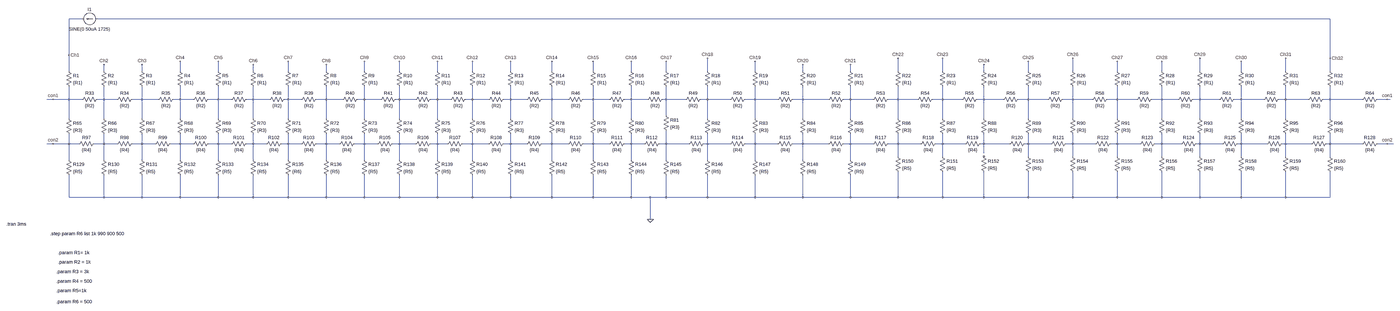
[diagram p0: schematic Resistor Phantom.asc, whole sheet]
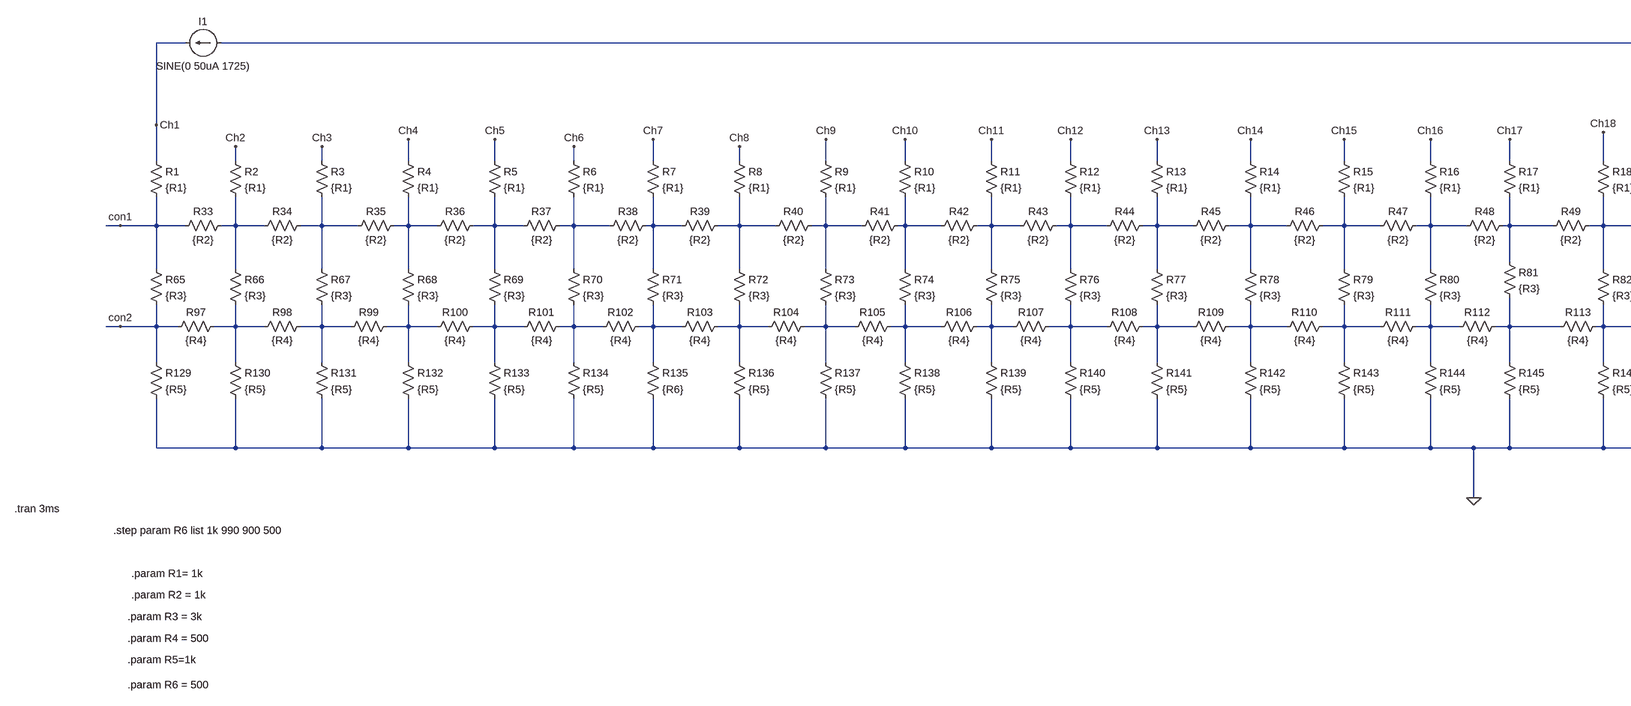
[diagram p1: schematic Resistor Phantom.asc, part, row 1 of 1, column 1 of 2]
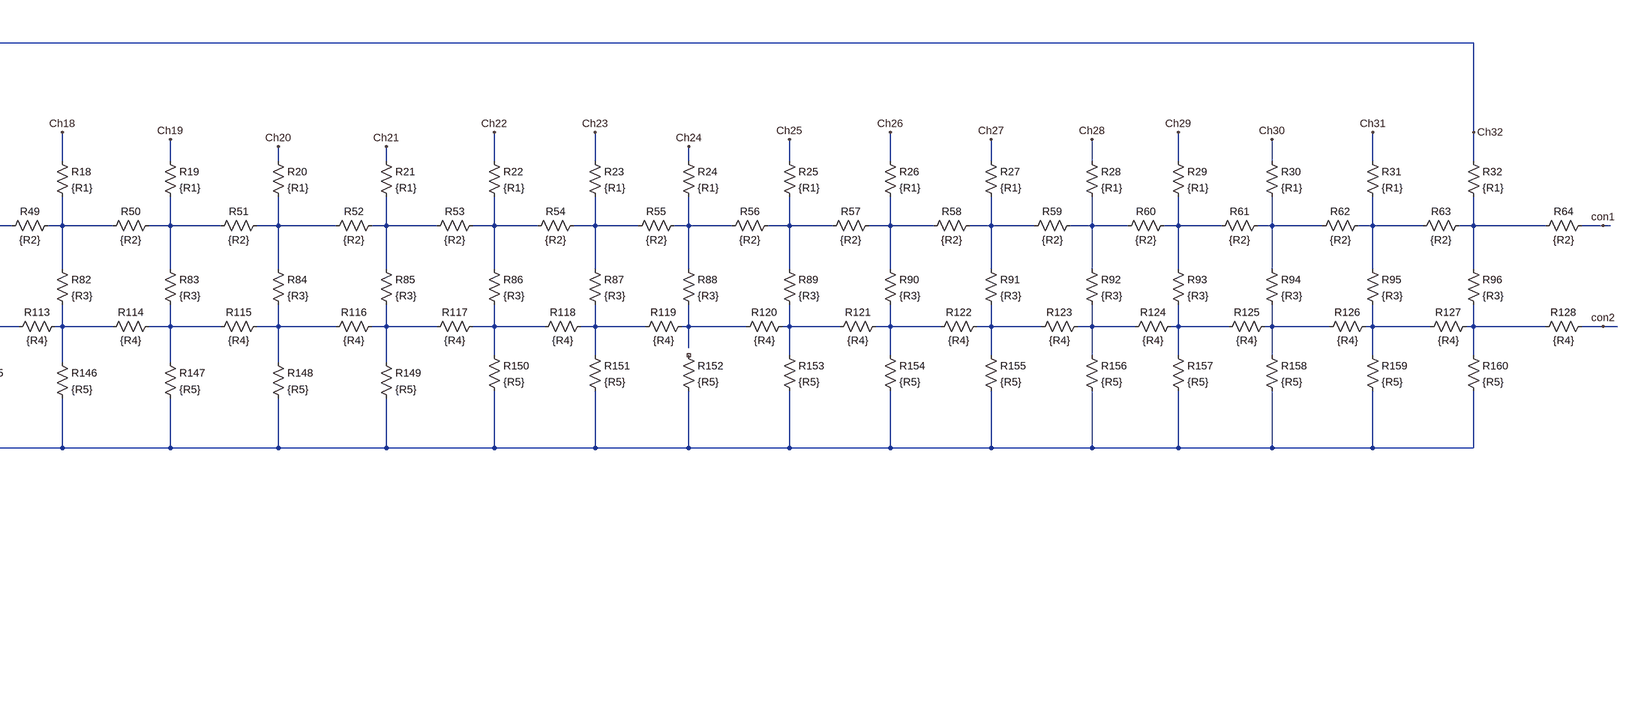
[diagram p2: schematic Resistor Phantom.asc, part, row 1 of 1, column 2 of 2]
Resistor Phantom.asc, the LTspice schematic file:
Version 4
SHEET 1 5484 864
WIRE -1136 -1120 -1200 -1120
WIRE 5152 -1120 -1056 -1120
WIRE -1200 -544 -1200 -1120
WIRE 5152 -528 5152 -1120
WIRE -1200 -464 -1200 -544
WIRE -1024 -464 -1024 -496
WIRE -832 -464 -832 -496
WIRE -640 -464 -640 -512
WIRE -448 -464 -448 -512
WIRE -272 -464 -272 -496
WIRE -96 -464 -96 -512
WIRE 96 -464 96 -496
WIRE 288 -464 288 -512
WIRE 464 -464 464 -512
WIRE 656 -464 656 -512
WIRE 832 -464 832 -512
WIRE 1024 -464 1024 -512
WIRE 1232 -464 1232 -512
WIRE 1440 -464 1440 -512
WIRE 1632 -464 1632 -512
WIRE 1808 -464 1808 -512
WIRE 2016 -464 2016 -528
WIRE 2256 -464 2256 -512
WIRE 2496 -464 2496 -496
WIRE 2736 -464 2736 -496
WIRE 2976 -464 2976 -528
WIRE 3200 -464 3200 -528
WIRE 3408 -464 3408 -496
WIRE 3632 -464 3632 -512
WIRE 3856 -464 3856 -528
WIRE 4080 -464 4080 -512
WIRE 4304 -464 4304 -512
WIRE 4496 -464 4496 -528
WIRE 4704 -464 4704 -512
WIRE 4928 -464 4928 -528
WIRE 5152 -464 5152 -528
WIRE -1280 -320 -1312 -320
WIRE -1200 -320 -1200 -384
WIRE -1200 -320 -1280 -320
WIRE -1136 -320 -1200 -320
WIRE -1024 -320 -1024 -384
WIRE -1024 -320 -1056 -320
WIRE -960 -320 -1024 -320
WIRE -832 -320 -832 -384
WIRE -832 -320 -880 -320
WIRE -752 -320 -832 -320
WIRE -640 -320 -640 -384
WIRE -640 -320 -672 -320
WIRE -576 -320 -640 -320
WIRE -448 -320 -448 -384
WIRE -448 -320 -496 -320
WIRE -384 -320 -448 -320
WIRE -272 -320 -272 -384
WIRE -272 -320 -304 -320
WIRE -192 -320 -272 -320
WIRE -96 -320 -96 -384
WIRE -96 -320 -112 -320
WIRE -32 -320 -96 -320
WIRE 96 -320 96 -384
WIRE 96 -320 48 -320
WIRE 176 -320 96 -320
WIRE 288 -320 288 -384
WIRE 288 -320 256 -320
WIRE 368 -320 288 -320
WIRE 464 -320 464 -384
WIRE 464 -320 448 -320
WIRE 544 -320 464 -320
WIRE 656 -320 656 -384
WIRE 656 -320 624 -320
WIRE 720 -320 656 -320
WIRE 832 -320 832 -384
WIRE 832 -320 800 -320
WIRE 912 -320 832 -320
WIRE 1024 -320 1024 -384
WIRE 1024 -320 992 -320
WIRE 1104 -320 1024 -320
WIRE 1232 -320 1232 -384
WIRE 1232 -320 1184 -320
WIRE 1312 -320 1232 -320
WIRE 1440 -320 1440 -384
WIRE 1440 -320 1392 -320
WIRE 1520 -320 1440 -320
WIRE 1632 -320 1632 -384
WIRE 1632 -320 1600 -320
WIRE 1712 -320 1632 -320
WIRE 1808 -320 1808 -384
WIRE 1808 -320 1792 -320
WIRE 1904 -320 1808 -320
WIRE 2016 -320 2016 -384
WIRE 2016 -320 1984 -320
WIRE 2128 -320 2016 -320
WIRE 2256 -320 2256 -384
WIRE 2256 -320 2208 -320
WIRE 2368 -320 2256 -320
WIRE 2496 -320 2496 -384
WIRE 2496 -320 2448 -320
WIRE 2624 -320 2496 -320
WIRE 2736 -320 2736 -384
WIRE 2736 -320 2704 -320
WIRE 2848 -320 2736 -320
WIRE 2976 -320 2976 -384
WIRE 2976 -320 2928 -320
WIRE 3072 -320 2976 -320
WIRE 3200 -320 3200 -384
WIRE 3200 -320 3152 -320
WIRE 3296 -320 3200 -320
WIRE 3408 -320 3408 -384
WIRE 3408 -320 3376 -320
WIRE 3504 -320 3408 -320
WIRE 3632 -320 3632 -384
WIRE 3632 -320 3584 -320
WIRE 3728 -320 3632 -320
WIRE 3856 -320 3856 -384
WIRE 3856 -320 3808 -320
WIRE 3952 -320 3856 -320
WIRE 4080 -320 4080 -384
WIRE 4080 -320 4032 -320
WIRE 4176 -320 4080 -320
WIRE 4304 -320 4304 -384
WIRE 4304 -320 4256 -320
WIRE 4384 -320 4304 -320
WIRE 4496 -320 4496 -384
WIRE 4496 -320 4464 -320
WIRE 4592 -320 4496 -320
WIRE 4704 -320 4704 -384
WIRE 4704 -320 4672 -320
WIRE 4816 -320 4704 -320
WIRE 4928 -320 4928 -384
WIRE 4928 -320 4896 -320
WIRE 5040 -320 4928 -320
WIRE 5152 -320 5152 -384
WIRE 5152 -320 5120 -320
WIRE 5312 -320 5152 -320
WIRE 5440 -320 5392 -320
WIRE 5456 -320 5440 -320
WIRE 1808 -240 1808 -320
WIRE -1200 -224 -1200 -320
WIRE -1024 -224 -1024 -320
WIRE -832 -224 -832 -320
WIRE -640 -224 -640 -320
WIRE -448 -224 -448 -320
WIRE -272 -224 -272 -320
WIRE -96 -224 -96 -320
WIRE 96 -224 96 -320
WIRE 288 -224 288 -320
WIRE 464 -224 464 -320
WIRE 656 -224 656 -320
WIRE 832 -224 832 -320
WIRE 1024 -224 1024 -320
WIRE 1232 -224 1232 -320
WIRE 1440 -224 1440 -320
WIRE 1632 -224 1632 -320
WIRE 2016 -224 2016 -320
WIRE 2256 -224 2256 -320
WIRE 2496 -224 2496 -320
WIRE 2736 -224 2736 -320
WIRE 2976 -224 2976 -320
WIRE 3200 -224 3200 -320
WIRE 3408 -224 3408 -320
WIRE 3632 -224 3632 -320
WIRE 3856 -224 3856 -320
WIRE 4080 -224 4080 -320
WIRE 4304 -224 4304 -320
WIRE 4496 -224 4496 -320
WIRE 4704 -224 4704 -320
WIRE 4928 -224 4928 -320
WIRE 5152 -224 5152 -320
WIRE -1280 -96 -1312 -96
WIRE -1200 -96 -1200 -144
WIRE -1200 -96 -1280 -96
WIRE -1152 -96 -1200 -96
WIRE -1024 -96 -1024 -144
WIRE -1024 -96 -1072 -96
WIRE -960 -96 -1024 -96
WIRE -832 -96 -832 -144
WIRE -832 -96 -880 -96
WIRE -768 -96 -832 -96
WIRE -640 -96 -640 -144
WIRE -640 -96 -688 -96
WIRE -576 -96 -640 -96
WIRE -448 -96 -448 -144
WIRE -448 -96 -496 -96
WIRE -384 -96 -448 -96
WIRE -272 -96 -272 -144
WIRE -272 -96 -304 -96
WIRE -208 -96 -272 -96
WIRE -96 -96 -96 -144
WIRE -96 -96 -128 -96
WIRE -32 -96 -96 -96
WIRE 96 -96 96 -144
WIRE 96 -96 48 -96
WIRE 160 -96 96 -96
WIRE 288 -96 288 -144
WIRE 288 -96 240 -96
WIRE 352 -96 288 -96
WIRE 464 -96 464 -144
WIRE 464 -96 432 -96
WIRE 544 -96 464 -96
WIRE 656 -96 656 -144
WIRE 656 -96 624 -96
WIRE 704 -96 656 -96
WIRE 832 -96 832 -144
WIRE 832 -96 784 -96
WIRE 912 -96 832 -96
WIRE 1024 -96 1024 -144
WIRE 1024 -96 992 -96
WIRE 1104 -96 1024 -96
WIRE 1232 -96 1232 -144
WIRE 1232 -96 1184 -96
WIRE 1312 -96 1232 -96
WIRE 1440 -96 1440 -144
WIRE 1440 -96 1392 -96
WIRE 1520 -96 1440 -96
WIRE 1632 -96 1632 -144
WIRE 1632 -96 1600 -96
WIRE 1696 -96 1632 -96
WIRE 1808 -96 1808 -160
WIRE 1808 -96 1776 -96
WIRE 1920 -96 1808 -96
WIRE 2016 -96 2016 -144
WIRE 2016 -96 2000 -96
WIRE 2128 -96 2016 -96
WIRE 2256 -96 2256 -144
WIRE 2256 -96 2208 -96
WIRE 2368 -96 2256 -96
WIRE 2496 -96 2496 -144
WIRE 2496 -96 2448 -96
WIRE 2624 -96 2496 -96
WIRE 2736 -96 2736 -144
WIRE 2736 -96 2704 -96
WIRE 2848 -96 2736 -96
WIRE 2976 -96 2976 -144
WIRE 2976 -96 2928 -96
WIRE 3088 -96 2976 -96
WIRE 3200 -96 3200 -144
WIRE 3200 -96 3168 -96
WIRE 3312 -96 3200 -96
WIRE 3408 -96 3408 -144
WIRE 3408 -96 3392 -96
WIRE 3536 -96 3408 -96
WIRE 3632 -96 3632 -144
WIRE 3632 -96 3616 -96
WIRE 3744 -96 3632 -96
WIRE 3856 -96 3856 -144
WIRE 3856 -96 3824 -96
WIRE 3968 -96 3856 -96
WIRE 4080 -96 4080 -144
WIRE 4080 -96 4048 -96
WIRE 4192 -96 4080 -96
WIRE 4304 -96 4304 -144
WIRE 4304 -96 4272 -96
WIRE 4400 -96 4304 -96
WIRE 4496 -96 4496 -144
WIRE 4496 -96 4480 -96
WIRE 4608 -96 4496 -96
WIRE 4704 -96 4704 -144
WIRE 4704 -96 4688 -96
WIRE 4832 -96 4704 -96
WIRE 4928 -96 4928 -144
WIRE 4928 -96 4912 -96
WIRE 5056 -96 4928 -96
WIRE 5152 -96 5152 -144
WIRE 5152 -96 5136 -96
WIRE 5312 -96 5152 -96
WIRE 5440 -96 5392 -96
WIRE 5472 -96 5440 -96
WIRE 3408 -48 3408 -96
WIRE 2976 -32 2976 -96
WIRE 3200 -32 3200 -96
WIRE 3632 -32 3632 -96
WIRE 3856 -32 3856 -96
WIRE 4080 -32 4080 -96
WIRE 4304 -32 4304 -96
WIRE 4496 -32 4496 -96
WIRE 4704 -32 4704 -96
WIRE 4928 -32 4928 -96
WIRE 5152 -32 5152 -96
WIRE -1200 -16 -1200 -96
WIRE -1024 -16 -1024 -96
WIRE -832 -16 -832 -96
WIRE -640 -16 -640 -96
WIRE -448 -16 -448 -96
WIRE -272 -16 -272 -96
WIRE -96 -16 -96 -96
WIRE 96 -16 96 -96
WIRE 288 -16 288 -96
WIRE 464 -16 464 -96
WIRE 656 -16 656 -96
WIRE 832 -16 832 -96
WIRE 1024 -16 1024 -96
WIRE 1232 -16 1232 -96
WIRE 1440 -16 1440 -96
WIRE 1632 -16 1632 -96
WIRE 1808 -16 1808 -96
WIRE 2016 -16 2016 -96
WIRE 2256 -16 2256 -96
WIRE 2496 -16 2496 -96
WIRE 2736 -16 2736 -96
WIRE -1200 304 -1200 64
WIRE -1024 304 -1024 64
WIRE -1024 304 -1200 304
WIRE -832 304 -832 64
WIRE -832 304 -1024 304
WIRE -640 304 -640 64
WIRE -640 304 -832 304
WIRE -448 304 -448 64
WIRE -448 304 -640 304
WIRE -272 304 -272 64
WIRE -272 304 -448 304
WIRE -96 304 -96 64
WIRE -96 304 -272 304
WIRE 96 304 96 64
WIRE 96 304 -96 304
WIRE 288 304 288 64
WIRE 288 304 96 304
WIRE 464 304 464 64
WIRE 464 304 288 304
WIRE 656 304 656 64
WIRE 656 304 464 304
WIRE 832 304 832 64
WIRE 832 304 656 304
WIRE 1024 304 1024 64
WIRE 1024 304 832 304
WIRE 1232 304 1232 64
WIRE 1232 304 1024 304
WIRE 1440 304 1440 64
WIRE 1440 304 1232 304
WIRE 1632 304 1632 64
WIRE 1632 304 1440 304
WIRE 1728 304 1632 304
WIRE 1808 304 1808 64
WIRE 1808 304 1728 304
WIRE 2016 304 2016 64
WIRE 2016 304 1808 304
WIRE 2256 304 2256 64
WIRE 2256 304 2016 304
WIRE 2496 304 2496 64
WIRE 2496 304 2256 304
WIRE 2736 304 2736 64
WIRE 2736 304 2496 304
WIRE 2976 304 2976 48
WIRE 2976 304 2736 304
WIRE 3200 304 3200 48
WIRE 3200 304 2976 304
WIRE 3408 304 3408 48
WIRE 3408 304 3200 304
WIRE 3632 304 3632 48
WIRE 3632 304 3408 304
WIRE 3856 304 3856 48
WIRE 3856 304 3632 304
WIRE 4080 304 4080 48
WIRE 4080 304 3856 304
WIRE 4304 304 4304 48
WIRE 4304 304 4080 304
WIRE 4496 304 4496 48
WIRE 4496 304 4304 304
WIRE 4704 304 4704 48
WIRE 4704 304 4496 304
WIRE 4928 304 4928 48
WIRE 4928 304 4704 304
WIRE 5152 304 5152 48
WIRE 5152 304 4928 304
WIRE 1728 432 1728 304
FLAG 1728 432 0
FLAG -1200 -544 Ch1
FLAG -1024 -496 Ch2
FLAG -832 -496 Ch3
FLAG -640 -512 Ch4
FLAG -448 -512 Ch5
FLAG -272 -496 Ch6
FLAG -96 -512 Ch7
FLAG 96 -496 Ch8
FLAG 288 -512 Ch9
FLAG 464 -512 Ch10
FLAG 656 -512 Ch11
FLAG 832 -512 Ch12
FLAG 1024 -512 Ch13
FLAG 1232 -512 Ch14
FLAG 1440 -512 Ch15
FLAG 1632 -512 Ch16
FLAG 1808 -512 Ch17
FLAG 2016 -528 Ch18
FLAG 2256 -512 Ch19
FLAG 2496 -496 Ch20
FLAG 2736 -496 Ch21
FLAG 2976 -528 Ch22
FLAG 3200 -528 Ch23
FLAG 3408 -496 Ch24
FLAG 3632 -512 Ch25
FLAG 3856 -528 Ch26
FLAG 4080 -512 Ch27
FLAG 4304 -512 Ch28
FLAG 4496 -528 Ch29
FLAG 4704 -512 Ch30
FLAG 4928 -528 Ch31
FLAG 5152 -528 Ch32
FLAG -1280 -320 con1
FLAG 5440 -320 con1
FLAG 5440 -96 con2
FLAG -1280 -96 con2
SYMBOL res -1216 -480 R0
SYMATTR InstName R1
SYMATTR Value {R1}
SYMBOL res -1040 -480 R0
SYMATTR InstName R2
SYMATTR Value {R1}
SYMBOL res -848 -480 R0
SYMATTR InstName R3
SYMATTR Value {R1}
SYMBOL res -656 -480 R0
SYMATTR InstName R4
SYMATTR Value {R1}
SYMBOL res -464 -480 R0
SYMATTR InstName R5
SYMATTR Value {R1}
SYMBOL res -288 -480 R0
SYMATTR InstName R6
SYMATTR Value {R1}
SYMBOL res -112 -480 R0
SYMATTR InstName R7
SYMATTR Value {R1}
SYMBOL res 80 -480 R0
SYMATTR InstName R8
SYMATTR Value {R1}
SYMBOL res 272 -480 R0
SYMATTR InstName R9
SYMATTR Value {R1}
SYMBOL res 448 -480 R0
SYMATTR InstName R10
SYMATTR Value {R1}
SYMBOL res 640 -480 R0
SYMATTR InstName R11
SYMATTR Value {R1}
SYMBOL res 816 -480 R0
SYMATTR InstName R12
SYMATTR Value {R1}
SYMBOL res 1008 -480 R0
SYMATTR InstName R13
SYMATTR Value {R1}
SYMBOL res 1216 -480 R0
SYMATTR InstName R14
SYMATTR Value {R1}
SYMBOL res 1424 -480 R0
SYMATTR InstName R15
SYMATTR Value {R1}
SYMBOL res 1616 -480 R0
SYMATTR InstName R16
SYMATTR Value {R1}
SYMBOL res 1792 -480 R0
SYMATTR InstName R17
SYMATTR Value {R1}
SYMBOL res 2000 -480 R0
SYMATTR InstName R18
SYMATTR Value {R1}
SYMBOL res 2240 -480 R0
SYMATTR InstName R19
SYMATTR Value {R1}
SYMBOL res 2480 -480 R0
SYMATTR InstName R20
SYMATTR Value {R1}
SYMBOL res 2720 -480 R0
SYMATTR InstName R21
SYMATTR Value {R1}
SYMBOL res 2960 -480 R0
SYMATTR InstName R22
SYMATTR Value {R1}
SYMBOL res 3184 -480 R0
SYMATTR InstName R23
SYMATTR Value {R1}
SYMBOL res 3392 -480 R0
SYMATTR InstName R24
SYMATTR Value {R1}
SYMBOL res 3616 -480 R0
SYMATTR InstName R25
SYMATTR Value {R1}
SYMBOL res 3840 -480 R0
SYMATTR InstName R26
SYMATTR Value {R1}
SYMBOL res 4064 -480 R0
SYMATTR InstName R27
SYMATTR Value {R1}
SYMBOL res 4288 -480 R0
SYMATTR InstName R28
SYMATTR Value {R1}
SYMBOL res 4480 -480 R0
SYMATTR InstName R29
SYMATTR Value {R1}
SYMBOL res 4688 -480 R0
SYMATTR InstName R30
SYMATTR Value {R1}
SYMBOL res 4912 -480 R0
SYMATTR InstName R31
SYMATTR Value {R1}
SYMBOL res 5136 -480 R0
SYMATTR InstName R32
SYMATTR Value {R1}
SYMBOL res -1040 -336 R90
WINDOW 0 0 56 VBottom 2
WINDOW 3 32 56 VTop 2
SYMATTR InstName R33
SYMATTR Value {R2}
SYMBOL res -864 -336 R90
WINDOW 0 0 56 VBottom 2
WINDOW 3 32 56 VTop 2
SYMATTR InstName R34
SYMATTR Value {R2}
SYMBOL res -656 -336 R90
WINDOW 0 0 56 VBottom 2
WINDOW 3 32 56 VTop 2
SYMATTR InstName R35
SYMATTR Value {R2}
SYMBOL res -480 -336 R90
WINDOW 0 0 56 VBottom 2
WINDOW 3 32 56 VTop 2
SYMATTR InstName R36
SYMATTR Value {R2}
SYMBOL res -288 -336 R90
WINDOW 0 0 56 VBottom 2
WINDOW 3 32 56 VTop 2
SYMATTR InstName R37
SYMATTR Value {R2}
SYMBOL res -96 -336 R90
WINDOW 0 0 56 VBottom 2
WINDOW 3 32 56 VTop 2
SYMATTR InstName R38
SYMATTR Value {R2}
SYMBOL res 64 -336 R90
WINDOW 0 0 56 VBottom 2
WINDOW 3 32 56 VTop 2
SYMATTR InstName R39
SYMATTR Value {R2}
SYMBOL res 272 -336 R90
WINDOW 0 0 56 VBottom 2
WINDOW 3 32 56 VTop 2
SYMATTR InstName R40
SYMATTR Value {R2}
SYMBOL res 464 -336 R90
WINDOW 0 0 56 VBottom 2
WINDOW 3 32 56 VTop 2
SYMATTR InstName R41
SYMATTR Value {R2}
SYMBOL res 640 -336 R90
WINDOW 0 0 56 VBottom 2
WINDOW 3 32 56 VTop 2
SYMATTR InstName R42
SYMATTR Value {R2}
SYMBOL res 816 -336 R90
WINDOW 0 0 56 VBottom 2
WINDOW 3 32 56 VTop 2
SYMATTR InstName R43
SYMATTR Value {R2}
SYMBOL res 1008 -336 R90
WINDOW 0 0 56 VBottom 2
WINDOW 3 32 56 VTop 2
SYMATTR InstName R44
SYMATTR Value {R2}
SYMBOL res 1200 -336 R90
WINDOW 0 0 56 VBottom 2
WINDOW 3 32 56 VTop 2
SYMATTR InstName R45
SYMATTR Value {R2}
SYMBOL res 1408 -336 R90
WINDOW 0 0 56 VBottom 2
WINDOW 3 32 56 VTop 2
SYMATTR InstName R46
SYMATTR Value {R2}
SYMBOL res 1616 -336 R90
WINDOW 0 0 56 VBottom 2
WINDOW 3 32 56 VTop 2
SYMATTR InstName R47
SYMATTR Value {R2}
SYMBOL res 1808 -336 R90
WINDOW 0 0 56 VBottom 2
WINDOW 3 32 56 VTop 2
SYMATTR InstName R48
SYMATTR Value {R2}
SYMBOL res 2000 -336 R90
WINDOW 0 0 56 VBottom 2
WINDOW 3 32 56 VTop 2
SYMATTR InstName R49
SYMATTR Value {R2}
SYMBOL res 2224 -336 R90
WINDOW 0 0 56 VBottom 2
WINDOW 3 32 56 VTop 2
SYMATTR InstName R50
SYMATTR Value {R2}
SYMBOL res 2464 -336 R90
WINDOW 0 0 56 VBottom 2
WINDOW 3 32 56 VTop 2
SYMATTR InstName R51
SYMATTR Value {R2}
SYMBOL res 2720 -336 R90
WINDOW 0 0 56 VBottom 2
WINDOW 3 32 56 VTop 2
SYMATTR InstName R52
SYMATTR Value {R2}
SYMBOL res 2944 -336 R90
WINDOW 0 0 56 VBottom 2
WINDOW 3 32 56 VTop 2
SYMATTR InstName R53
SYMATTR Value {R2}
SYMBOL res 3168 -336 R90
WINDOW 0 0 56 VBottom 2
WINDOW 3 32 56 VTop 2
SYMATTR InstName R54
SYMATTR Value {R2}
SYMBOL res 3392 -336 R90
WINDOW 0 0 56 VBottom 2
WINDOW 3 32 56 VTop 2
SYMATTR InstName R55
SYMATTR Value {R2}
SYMBOL res 3600 -336 R90
WINDOW 0 0 56 VBottom 2
WINDOW 3 32 56 VTop 2
SYMATTR InstName R56
SYMATTR Value {R2}
SYMBOL res 3824 -336 R90
WINDOW 0 0 56 VBottom 2
WINDOW 3 32 56 VTop 2
SYMATTR InstName R57
SYMATTR Value {R2}
SYMBOL res 4048 -336 R90
WINDOW 0 0 56 VBottom 2
WINDOW 3 32 56 VTop 2
SYMATTR InstName R58
SYMATTR Value {R2}
SYMBOL res 4272 -336 R90
WINDOW 0 0 56 VBottom 2
WINDOW 3 32 56 VTop 2
SYMATTR InstName R59
SYMATTR Value {R2}
SYMBOL res 4480 -336 R90
WINDOW 0 0 56 VBottom 2
WINDOW 3 32 56 VTop 2
SYMATTR InstName R60
SYMATTR Value {R2}
SYMBOL res 4688 -336 R90
WINDOW 0 0 56 VBottom 2
WINDOW 3 32 56 VTop 2
SYMATTR InstName R61
SYMATTR Value {R2}
SYMBOL res 4912 -336 R90
WINDOW 0 0 56 VBottom 2
WINDOW 3 32 56 VTop 2
SYMATTR InstName R62
SYMATTR Value {R2}
SYMBOL res 5136 -336 R90
WINDOW 0 0 56 VBottom 2
WINDOW 3 32 56 VTop 2
SYMATTR InstName R63
SYMATTR Value {R2}
SYMBOL res 5408 -336 R90
WINDOW 0 0 56 VBottom 2
WINDOW 3 32 56 VTop 2
SYMATTR InstName R64
SYMATTR Value {R2}
SYMBOL res -1216 -240 R0
SYMATTR InstName R65
SYMATTR Value {R3}
SYMBOL res -1040 -240 R0
SYMATTR InstName R66
SYMATTR Value {R3}
SYMBOL res -848 -240 R0
SYMATTR InstName R67
SYMATTR Value {R3}
SYMBOL res -656 -240 R0
SYMATTR InstName R68
SYMATTR Value {R3}
SYMBOL res -464 -240 R0
SYMATTR InstName R69
SYMATTR Value {R3}
SYMBOL res -288 -240 R0
SYMATTR InstName R70
SYMATTR Value {R3}
SYMBOL res -112 -240 R0
SYMATTR InstName R71
SYMATTR Value {R3}
SYMBOL res 80 -240 R0
SYMATTR InstName R72
SYMATTR Value {R3}
SYMBOL res 272 -240 R0
SYMATTR InstName R73
SYMATTR Value {R3}
SYMBOL res 448 -240 R0
SYMATTR InstName R74
SYMATTR Value {R3}
SYMBOL res 640 -240 R0
SYMATTR InstName R75
SYMATTR Value {R3}
SYMBOL res 816 -240 R0
SYMATTR InstName R76
SYMATTR Value {R3}
SYMBOL res 1008 -240 R0
SYMATTR InstName R77
SYMATTR Value {R3}
SYMBOL res 1216 -240 R0
SYMATTR InstName R78
SYMATTR Value {R3}
SYMBOL res 1424 -240 R0
SYMATTR InstName R79
SYMATTR Value {R3}
SYMBOL res 1616 -240 R0
SYMATTR InstName R80
SYMATTR Value {R3}
SYMBOL res 1792 -256 R0
SYMATTR InstName R81
SYMATTR Value {R3}
SYMBOL res 2000 -240 R0
SYMATTR InstName R82
SYMATTR Value {R3}
SYMBOL res 2240 -240 R0
SYMATTR InstName R83
SYMATTR Value {R3}
SYMBOL res 2480 -240 R0
SYMATTR InstName R84
SYMATTR Value {R3}
SYMBOL res 2720 -240 R0
SYMATTR InstName R85
SYMATTR Value {R3}
SYMBOL res 2960 -240 R0
SYMATTR InstName R86
SYMATTR Value {R3}
SYMBOL res 3184 -240 R0
SYMATTR InstName R87
SYMATTR Value {R3}
SYMBOL res 3392 -240 R0
SYMATTR InstName R88
SYMATTR Value {R3}
SYMBOL res 3616 -240 R0
SYMATTR InstName R89
SYMATTR Value {R3}
SYMBOL res 3840 -240 R0
SYMATTR InstName R90
SYMATTR Value {R3}
SYMBOL res 4064 -240 R0
SYMATTR InstName R91
SYMATTR Value {R3}
SYMBOL res 4288 -240 R0
SYMATTR InstName R92
SYMATTR Value {R3}
SYMBOL res 4480 -240 R0
SYMATTR InstName R93
SYMATTR Value {R3}
SYMBOL res 4688 -240 R0
SYMATTR InstName R94
SYMATTR Value {R3}
SYMBOL res 4912 -240 R0
SYMATTR InstName R95
SYMATTR Value {R3}
SYMBOL res 5136 -240 R0
SYMATTR InstName R96
SYMATTR Value {R3}
SYMBOL res -1056 -112 R90
WINDOW 0 0 56 VBottom 2
WINDOW 3 32 56 VTop 2
SYMATTR InstName R97
SYMATTR Value {R4}
SYMBOL res -864 -112 R90
WINDOW 0 0 56 VBottom 2
WINDOW 3 32 56 VTop 2
SYMATTR InstName R98
SYMATTR Value {R4}
SYMBOL res -672 -112 R90
WINDOW 0 0 56 VBottom 2
WINDOW 3 32 56 VTop 2
SYMATTR InstName R99
SYMATTR Value {R4}
SYMBOL res -480 -112 R90
WINDOW 0 0 56 VBottom 2
WINDOW 3 32 56 VTop 2
SYMATTR InstName R100
SYMATTR Value {R4}
SYMBOL res -288 -112 R90
WINDOW 0 0 56 VBottom 2
WINDOW 3 32 56 VTop 2
SYMATTR InstName R101
SYMATTR Value {R4}
SYMBOL res -112 -112 R90
WINDOW 0 0 56 VBottom 2
WINDOW 3 32 56 VTop 2
SYMATTR InstName R102
SYMATTR Value {R4}
SYMBOL res 64 -112 R90
WINDOW 0 0 56 VBottom 2
WINDOW 3 32 56 VTop 2
SYMATTR InstName R103
SYMATTR Value {R4}
SYMBOL res 256 -112 R90
WINDOW 0 0 56 VBottom 2
WINDOW 3 32 56 VTop 2
SYMATTR InstName R104
SYMATTR Value {R4}
SYMBOL res 448 -112 R90
WINDOW 0 0 56 VBottom 2
WINDOW 3 32 56 VTop 2
SYMATTR InstName R105
SYMATTR Value {R4}
SYMBOL res 640 -112 R90
WINDOW 0 0 56 VBottom 2
WINDOW 3 32 56 VTop 2
SYMATTR InstName R106
SYMATTR Value {R4}
SYMBOL res 800 -112 R90
WINDOW 0 0 56 VBottom 2
WINDOW 3 32 56 VTop 2
SYMATTR InstName R107
SYMATTR Value {R4}
SYMBOL res 1008 -112 R90
WINDOW 0 0 56 VBottom 2
WINDOW 3 32 56 VTop 2
SYMATTR InstName R108
SYMATTR Value {R4}
SYMBOL res 1200 -112 R90
WINDOW 0 0 56 VBottom 2
WINDOW 3 32 56 VTop 2
SYMATTR InstName R109
SYMATTR Value {R4}
SYMBOL res 1408 -112 R90
WINDOW 0 0 56 VBottom 2
WINDOW 3 32 56 VTop 2
SYMATTR InstName R110
SYMATTR Value {R4}
SYMBOL res 1616 -112 R90
WINDOW 0 0 56 VBottom 2
WINDOW 3 32 56 VTop 2
SYMATTR InstName R111
SYMATTR Value {R4}
SYMBOL res 1792 -112 R90
WINDOW 0 0 56 VBottom 2
WINDOW 3 32 56 VTop 2
SYMATTR InstName R112
SYMATTR Value {R4}
SYMBOL res 2016 -112 R90
WINDOW 0 0 56 VBottom 2
WINDOW 3 32 56 VTop 2
SYMATTR InstName R113
SYMATTR Value {R4}
SYMBOL res 2224 -112 R90
WINDOW 0 0 56 VBottom 2
WINDOW 3 32 56 VTop 2
SYMATTR InstName R114
SYMATTR Value {R4}
SYMBOL res 2464 -112 R90
WINDOW 0 0 56 VBottom 2
WINDOW 3 32 56 VTop 2
SYMATTR InstName R115
SYMATTR Value {R4}
SYMBOL res 2720 -112 R90
WINDOW 0 0 56 VBottom 2
WINDOW 3 32 56 VTop 2
SYMATTR InstName R116
SYMATTR Value {R4}
SYMBOL res 2944 -112 R90
WINDOW 0 0 56 VBottom 2
WINDOW 3 32 56 VTop 2
SYMATTR InstName R117
SYMATTR Value {R4}
SYMBOL res 3184 -112 R90
WINDOW 0 0 56 VBottom 2
WINDOW 3 32 56 VTop 2
SYMATTR InstName R118
SYMATTR Value {R4}
SYMBOL res 3408 -112 R90
WINDOW 0 0 56 VBottom 2
WINDOW 3 32 56 VTop 2
SYMATTR InstName R119
SYMATTR Value {R4}
SYMBOL res 3632 -112 R90
WINDOW 0 0 56 VBottom 2
WINDOW 3 32 56 VTop 2
SYMATTR InstName R120
SYMATTR Value {R4}
SYMBOL res 3840 -112 R90
WINDOW 0 0 56 VBottom 2
WINDOW 3 32 56 VTop 2
SYMATTR InstName R121
SYMATTR Value {R4}
SYMBOL res 4064 -112 R90
WINDOW 0 0 56 VBottom 2
WINDOW 3 32 56 VTop 2
SYMATTR InstName R122
SYMATTR Value {R4}
SYMBOL res 4288 -112 R90
WINDOW 0 0 56 VBottom 2
WINDOW 3 32 56 VTop 2
SYMATTR InstName R123
SYMATTR Value {R4}
SYMBOL res 4496 -112 R90
WINDOW 0 0 56 VBottom 2
WINDOW 3 32 56 VTop 2
SYMATTR InstName R124
SYMATTR Value {R4}
SYMBOL res 4704 -112 R90
WINDOW 0 0 56 VBottom 2
WINDOW 3 32 56 VTop 2
SYMATTR InstName R125
SYMATTR Value {R4}
SYMBOL res 4928 -112 R90
WINDOW 0 0 56 VBottom 2
WINDOW 3 32 56 VTop 2
SYMATTR InstName R126
SYMATTR Value {R4}
SYMBOL res 5152 -112 R90
WINDOW 0 0 56 VBottom 2
WINDOW 3 32 56 VTop 2
SYMATTR InstName R127
SYMATTR Value {R4}
SYMBOL res 5408 -112 R90
WINDOW 0 0 56 VBottom 2
WINDOW 3 32 56 VTop 2
SYMATTR InstName R128
SYMATTR Value {R4}
SYMBOL res -1216 -32 R0
SYMATTR InstName R129
SYMATTR Value {R5}
SYMBOL res -1040 -32 R0
SYMATTR InstName R130
SYMATTR Value {R5}
SYMBOL res -848 -32 R0
SYMATTR InstName R131
SYMATTR Value {R5}
SYMBOL res -656 -32 R0
SYMATTR InstName R132
SYMATTR Value {R5}
SYMBOL res -464 -32 R0
SYMATTR InstName R133
SYMATTR Value {R5}
SYMBOL res -288 -32 R0
SYMATTR InstName R134
SYMATTR Value {R5}
SYMBOL res -112 -32 R0
SYMATTR InstName R135
SYMATTR Value {R6}
SYMBOL res 80 -32 R0
SYMATTR InstName R136
SYMATTR Value {R5}
SYMBOL res 272 -32 R0
SYMATTR InstName R137
SYMATTR Value {R5}
SYMBOL res 448 -32 R0
SYMATTR InstName R138
SYMATTR Value {R5}
SYMBOL res 640 -32 R0
SYMATTR InstName R139
SYMATTR Value {R5}
SYMBOL res 816 -32 R0
SYMATTR InstName R140
SYMATTR Value {R5}
SYMBOL res 1008 -32 R0
SYMATTR InstName R141
SYMATTR Value {R5}
SYMBOL res 1216 -32 R0
SYMATTR InstName R142
SYMATTR Value {R5}
SYMBOL res 1424 -32 R0
SYMATTR InstName R143
SYMATTR Value {R5}
SYMBOL res 1616 -32 R0
SYMATTR InstName R144
SYMATTR Value {R5}
SYMBOL res 1792 -32 R0
SYMATTR InstName R145
SYMATTR Value {R5}
SYMBOL res 2000 -32 R0
SYMATTR InstName R146
SYMATTR Value {R5}
SYMBOL res 2240 -32 R0
SYMATTR InstName R147
SYMATTR Value {R5}
SYMBOL res 2480 -32 R0
SYMATTR InstName R148
SYMATTR Value {R5}
SYMBOL res 2720 -32 R0
SYMATTR InstName R149
SYMATTR Value {R5}
SYMBOL res 2960 -48 R0
SYMATTR InstName R150
SYMATTR Value {R5}
SYMBOL res 3184 -48 R0
SYMATTR InstName R151
SYMATTR Value {R5}
SYMBOL res 3392 -48 R0
SYMATTR InstName R152
SYMATTR Value {R5}
SYMBOL res 3616 -48 R0
SYMATTR InstName R153
SYMATTR Value {R5}
SYMBOL res 3840 -48 R0
SYMATTR InstName R154
SYMATTR Value {R5}
SYMBOL res 4064 -48 R0
SYMATTR InstName R155
SYMATTR Value {R5}
SYMBOL res 4288 -48 R0
SYMATTR InstName R156
SYMATTR Value {R5}
SYMBOL res 4480 -48 R0
SYMATTR InstName R157
SYMATTR Value {R5}
SYMBOL res 4688 -48 R0
SYMATTR InstName R158
SYMATTR Value {R5}
SYMBOL res 4912 -48 R0
SYMATTR InstName R159
SYMATTR Value {R5}
SYMBOL res 5136 -48 R0
SYMATTR InstName R160
SYMATTR Value {R5}
SYMBOL load2 -1056 -1120 R90
WINDOW 0 -32 40 VBottom 2
WINDOW 3 36 40 VTop 2
WINDOW 123 0 0 Left 2
WINDOW 39 0 0 Left 2
SYMATTR InstName I1
SYMATTR Value SINE(0 50uA 1725)
TEXT -1256 600 Left 2 !.param R1= 1k
TEXT -1256 648 Left 2 !.param R2 = 1k
TEXT -1264 696 Left 2 !.param R3 = 3k
TEXT -1264 744 Left 2 !.param R4 = 500
TEXT -1264 792 Left 2 !.param R5=1k
TEXT -1704 456 Left 2 !.tran 3ms
TEXT -1264 848 Left 2 !.param R6 = 500
TEXT -1296 504 Left 2 !.step param R6 list 1k 990 900 500

The netlist it stands for:
* Resistor Phantom.asc
R1 Ch1 con1 {R1}
R2 Ch2 N001 {R1}
R3 Ch3 N002 {R1}
R4 Ch4 N003 {R1}
R5 Ch5 N004 {R1}
R6 Ch6 N005 {R1}
R7 Ch7 N006 {R1}
R8 Ch8 N007 {R1}
R9 Ch9 N008 {R1}
R10 Ch10 N009 {R1}
R11 Ch11 N010 {R1}
R12 Ch12 N011 {R1}
R13 Ch13 N012 {R1}
R14 Ch14 N013 {R1}
R15 Ch15 N014 {R1}
R16 Ch16 N015 {R1}
R17 Ch17 N016 {R1}
R18 Ch18 N017 {R1}
R19 Ch19 N018 {R1}
R20 Ch20 N019 {R1}
R21 Ch21 N020 {R1}
R22 Ch22 N021 {R1}
R23 Ch23 N022 {R1}
R24 Ch24 N023 {R1}
R25 Ch25 N024 {R1}
R26 Ch26 N025 {R1}
R27 Ch27 N026 {R1}
R28 Ch28 N027 {R1}
R29 Ch29 N028 {R1}
R30 Ch30 N029 {R1}
R31 Ch31 N030 {R1}
R32 Ch32 N031 {R1}
R33 N001 con1 {R2}
R34 N002 N001 {R2}
R35 N003 N002 {R2}
R36 N004 N003 {R2}
R37 N005 N004 {R2}
R38 N006 N005 {R2}
R39 N007 N006 {R2}
R40 N008 N007 {R2}
R41 N009 N008 {R2}
R42 N010 N009 {R2}
R43 N011 N010 {R2}
R44 N012 N011 {R2}
R45 N013 N012 {R2}
R46 N014 N013 {R2}
R47 N015 N014 {R2}
R48 N016 N015 {R2}
R49 N017 N016 {R2}
R50 N018 N017 {R2}
R51 N019 N018 {R2}
R52 N020 N019 {R2}
R53 N021 N020 {R2}
R54 N022 N021 {R2}
R55 N023 N022 {R2}
R56 N024 N023 {R2}
R57 N025 N024 {R2}
R58 N026 N025 {R2}
R59 N027 N026 {R2}
R60 N028 N027 {R2}
R61 N029 N028 {R2}
R62 N030 N029 {R2}
R63 N031 N030 {R2}
R64 con1 N031 {R2}
R65 con1 con2 {R3}
R66 N001 N032 {R3}
R67 N002 N033 {R3}
R68 N003 N034 {R3}
R69 N004 N035 {R3}
R70 N005 N036 {R3}
R71 N006 N037 {R3}
R72 N007 N038 {R3}
R73 N008 N039 {R3}
R74 N009 N040 {R3}
R75 N010 N041 {R3}
R76 N011 N042 {R3}
R77 N012 N043 {R3}
R78 N013 N044 {R3}
R79 N014 N045 {R3}
R80 N015 N046 {R3}
R81 N016 N047 {R3}
R82 N017 N048 {R3}
R83 N018 N049 {R3}
R84 N019 N050 {R3}
R85 N020 N051 {R3}
R86 N021 N052 {R3}
R87 N022 N053 {R3}
R88 N023 N054 {R3}
R89 N024 N055 {R3}
R90 N025 N056 {R3}
R91 N026 N057 {R3}
R92 N027 N058 {R3}
R93 N028 N059 {R3}
R94 N029 N060 {R3}
R95 N030 N061 {R3}
R96 N031 N062 {R3}
R97 N032 con2 {R4}
R98 N033 N032 {R4}
R99 N034 N033 {R4}
R100 N035 N034 {R4}
R101 N036 N035 {R4}
R102 N037 N036 {R4}
R103 N038 N037 {R4}
R104 N039 N038 {R4}
R105 N040 N039 {R4}
R106 N041 N040 {R4}
R107 N042 N041 {R4}
R108 N043 N042 {R4}
R109 N044 N043 {R4}
R110 N045 N044 {R4}
R111 N046 N045 {R4}
R112 N047 N046 {R4}
R113 N048 N047 {R4}
R114 N049 N048 {R4}
R115 N050 N049 {R4}
R116 N051 N050 {R4}
R117 N052 N051 {R4}
R118 N053 N052 {R4}
R119 N054 N053 {R4}
R120 N055 N054 {R4}
R121 N056 N055 {R4}
R122 N057 N056 {R4}
R123 N058 N057 {R4}
R124 N059 N058 {R4}
R125 N060 N059 {R4}
R126 N061 N060 {R4}
R127 N062 N061 {R4}
R128 con2 N062 {R4}
R129 con2 0 {R5}
R130 N032 0 {R5}
R131 N033 0 {R5}
R132 N034 0 {R5}
R133 N035 0 {R5}
R134 N036 0 {R5}
R135 N037 0 {R6}
R136 N038 0 {R5}
R137 N039 0 {R5}
R138 N040 0 {R5}
R139 N041 0 {R5}
R140 N042 0 {R5}
R141 N043 0 {R5}
R142 N044 0 {R5}
R143 N045 0 {R5}
R144 N046 0 {R5}
R145 N047 0 {R5}
R146 N048 0 {R5}
R147 N049 0 {R5}
R148 N050 0 {R5}
R149 N051 0 {R5}
R150 N052 0 {R5}
R151 N053 0 {R5}
R152 NC_01 0 {R5}
R153 N055 0 {R5}
R154 N056 0 {R5}
R155 N057 0 {R5}
R156 N058 0 {R5}
R157 N059 0 {R5}
R158 N060 0 {R5}
R159 N061 0 {R5}
R160 N062 0 {R5}
I1 Ch32 Ch1 SINE(0 50uA 1725)
.param R1= 1k
.param R2 = 1k
.param R3 = 3k
.param R4 = 500
.param R5=1k
.tran 3ms
.param R6 = 500
.step param R6 list 1k 990 900 500
.backanno
.end

* Results of the author's LTspice run, read from the files saved beside the schematic
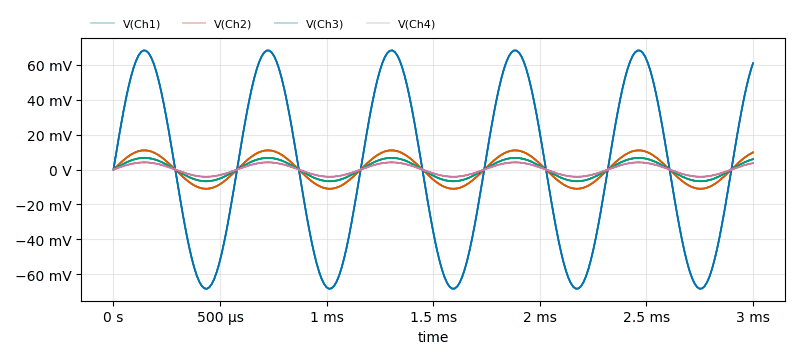
[diagram p3: Transient Analysis of Resistor Phantom.asc, plotted from the saved traces]
* Transient Analysis, 4 runs:
*   V(Ch1) [r6=1000]: min -68.39 mV, max 68.38 mV, average 1.148 mV, rms 48.08 mV, last 60.98 mV
*   V(Ch1) [r6=990]: min -68.39 mV, max 68.38 mV, average 1.148 mV, rms 48.08 mV, last 60.98 mV
*   V(Ch1) [r6=900]: min -68.39 mV, max 68.38 mV, average 1.148 mV, rms 48.08 mV, last 60.98 mV
*   V(Ch1) [r6=500]: min -68.39 mV, max 68.37 mV, average 1.147 mV, rms 48.08 mV, last 60.97 mV
*   V(Ch2) [r6=1000]: min -11.02 mV, max 11.02 mV, average 184.9 µV, rms 7.746 mV, last 9.824 mV
*   V(Ch2) [r6=990]: min -11.02 mV, max 11.02 mV, average 184.9 µV, rms 7.746 mV, last 9.824 mV
*   V(Ch2) [r6=900]: min -11.02 mV, max 11.02 mV, average 184.9 µV, rms 7.745 mV, last 9.823 mV
*   V(Ch2) [r6=500]: min -11.01 mV, max 11.01 mV, average 184.8 µV, rms 7.741 mV, last 9.817 mV
*   V(Ch3) [r6=1000]: min -6.705 mV, max 6.704 mV, average 112.5 µV, rms 4.714 mV, last 5.978 mV
*   V(Ch3) [r6=990]: min -6.705 mV, max 6.704 mV, average 112.5 µV, rms 4.714 mV, last 5.978 mV
*   V(Ch3) [r6=900]: min -6.704 mV, max 6.702 mV, average 112.5 µV, rms 4.713 mV, last 5.977 mV
*   V(Ch3) [r6=500]: min -6.694 mV, max 6.693 mV, average 112.3 µV, rms 4.706 mV, last 5.968 mV
*   V(Ch4) [r6=1000]: min -4.133 mV, max 4.132 mV, average 69.34 µV, rms 2.905 mV, last 3.685 mV
*   V(Ch4) [r6=990]: min -4.132 mV, max 4.132 mV, average 69.34 µV, rms 2.905 mV, last 3.684 mV
*   V(Ch4) [r6=900]: min -4.13 mV, max 4.129 mV, average 69.3 µV, rms 2.904 mV, last 3.682 mV
*   V(Ch4) [r6=500]: min -4.115 mV, max 4.115 mV, average 69.05 µV, rms 2.893 mV, last 3.669 mV